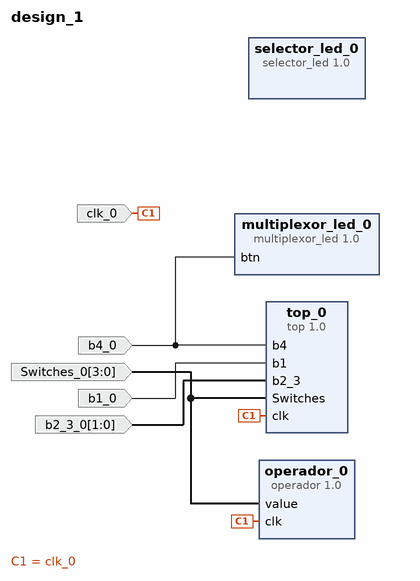
[diagram p0: block diagram of the top level]
# Vivado block design design_1, xc7z010clg400-1, Vivado 2020.1
create_bd_design design_1

create_bd_port -dir I -type clk clk_0
create_bd_port -dir I b1_0
create_bd_port -dir I -from 1 -to 0 b2_3_0
create_bd_port -dir I b4_0
create_bd_port -dir I -from 3 -to 0 Switches_0

create_bd_cell -type ip -vlnv xilinx.com:user:multiplexor_led:1.0 multiplexor_led_0
create_bd_cell -type ip -vlnv xilinx.com:user:selector_led:1.0 selector_led_0
create_bd_cell -type ip -vlnv xilinx.com:user:operador:1.0 operador_0
create_bd_cell -type ip -vlnv xilinx.com:user:top:1.0 top_0

# ---- connections ----

connect_bd_net -net clk_0_1 [get_bd_ports clk_0] [get_bd_pins top_0/clk] [get_bd_pins operador_0/clk]
connect_bd_net -net b1_0_1 [get_bd_ports b1_0] [get_bd_pins top_0/b1]
connect_bd_net -net b2_3_0_1 [get_bd_ports b2_3_0] [get_bd_pins top_0/b2_3]
connect_bd_net -net b4_0_1 [get_bd_ports b4_0] [get_bd_pins top_0/b4] [get_bd_pins multiplexor_led_0/btn]
connect_bd_net -net Switches_0_1 [get_bd_ports Switches_0] [get_bd_pins top_0/Switches] [get_bd_pins operador_0/value]

validate_bd_design
save_bd_design
